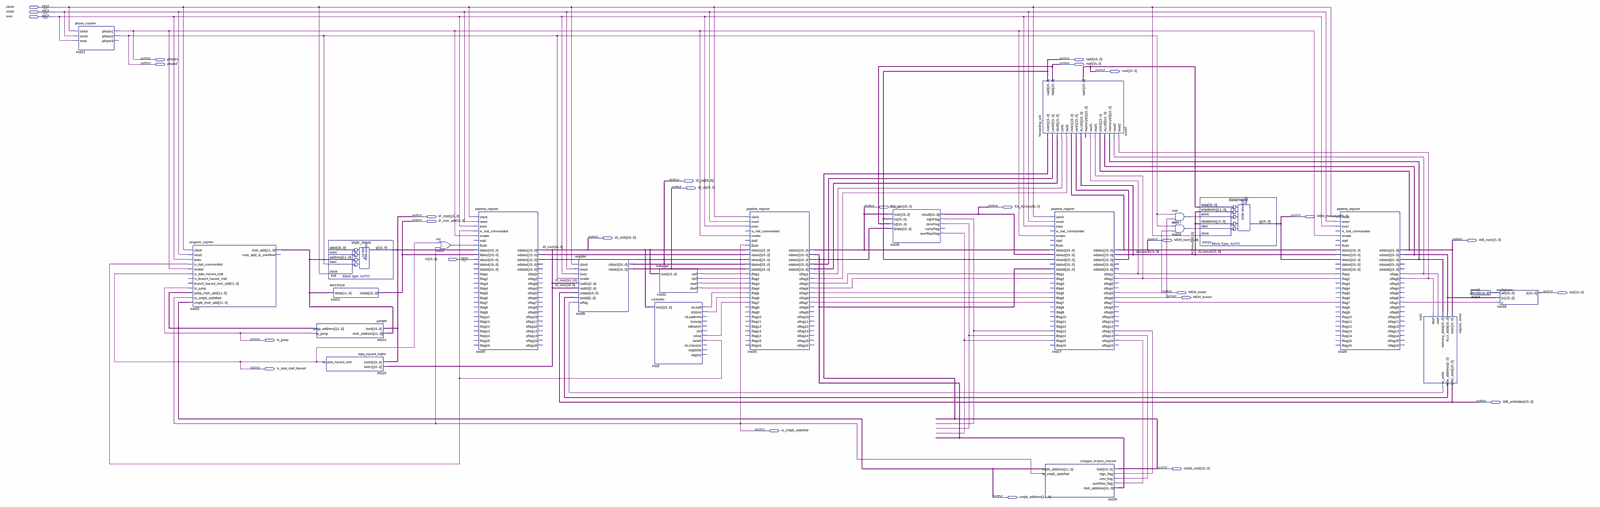
[diagram p0: schematic sheet, whole]
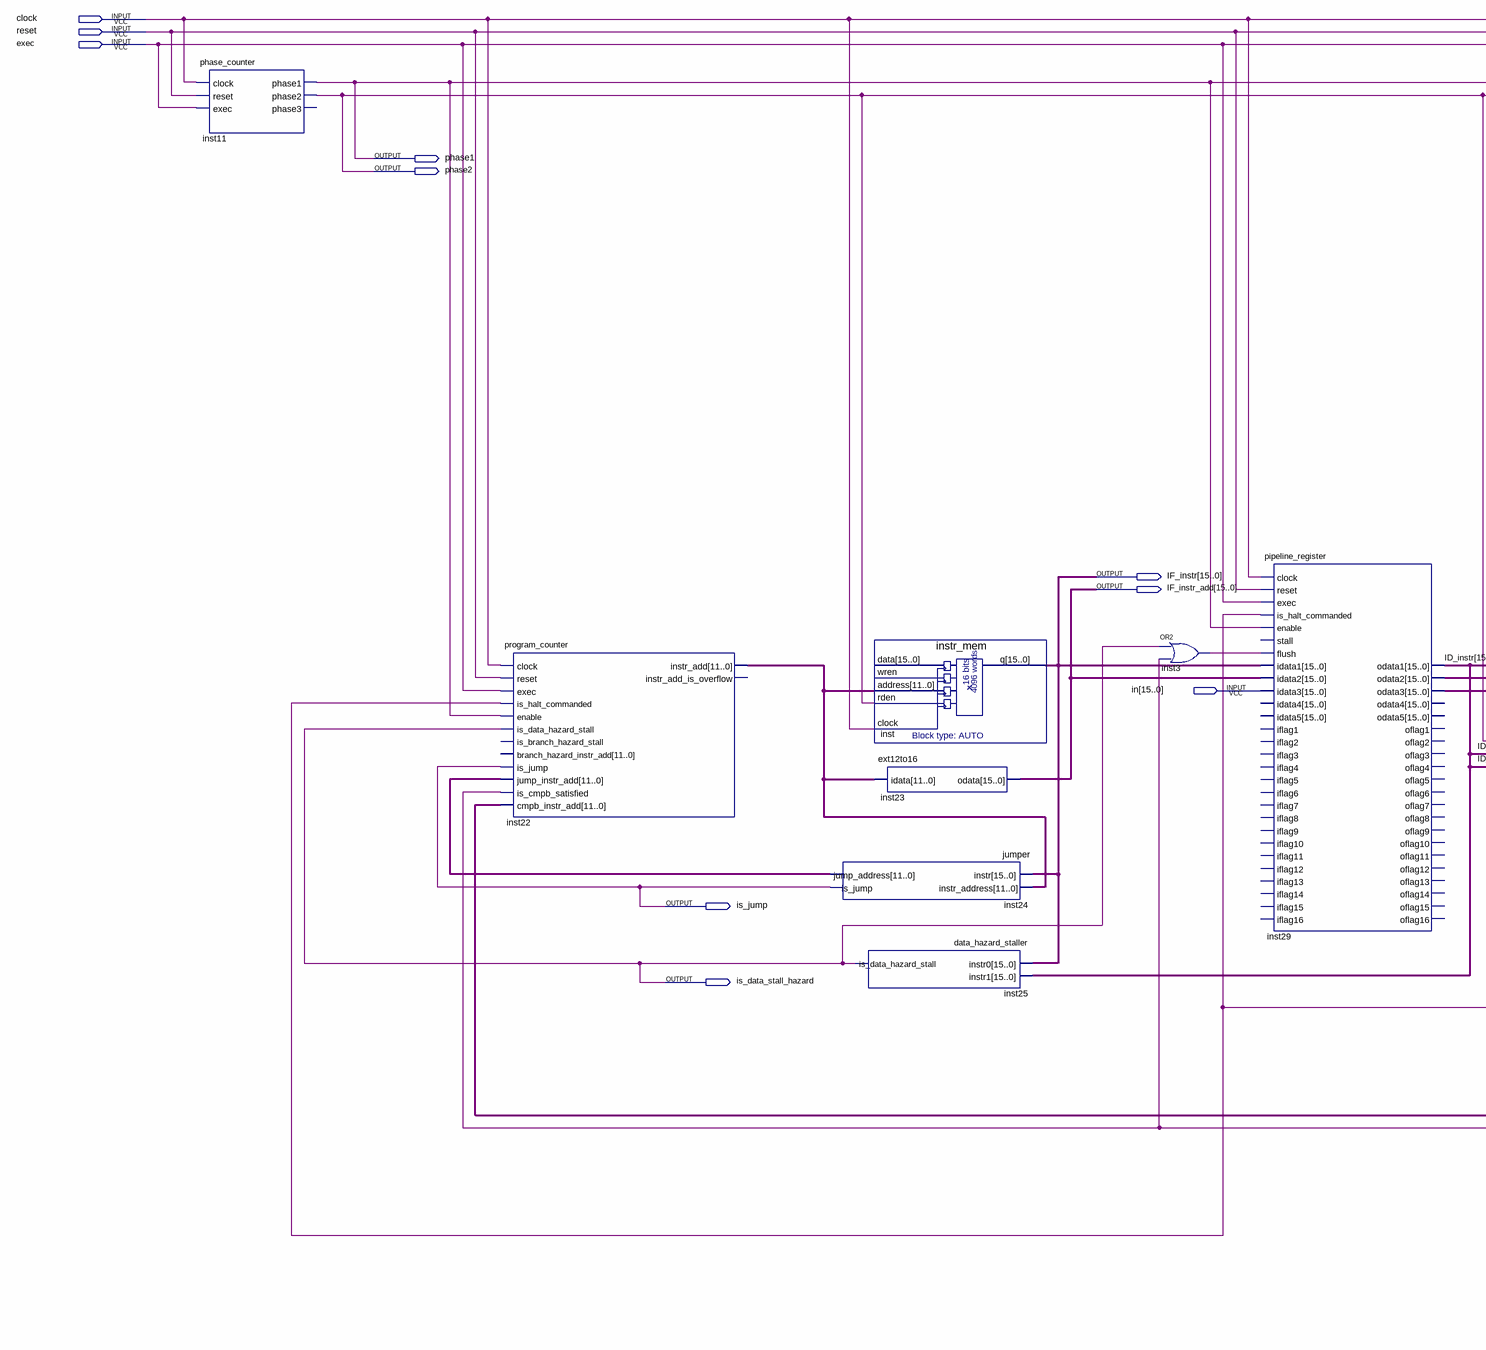
[diagram p1: schematic sheet, left part]
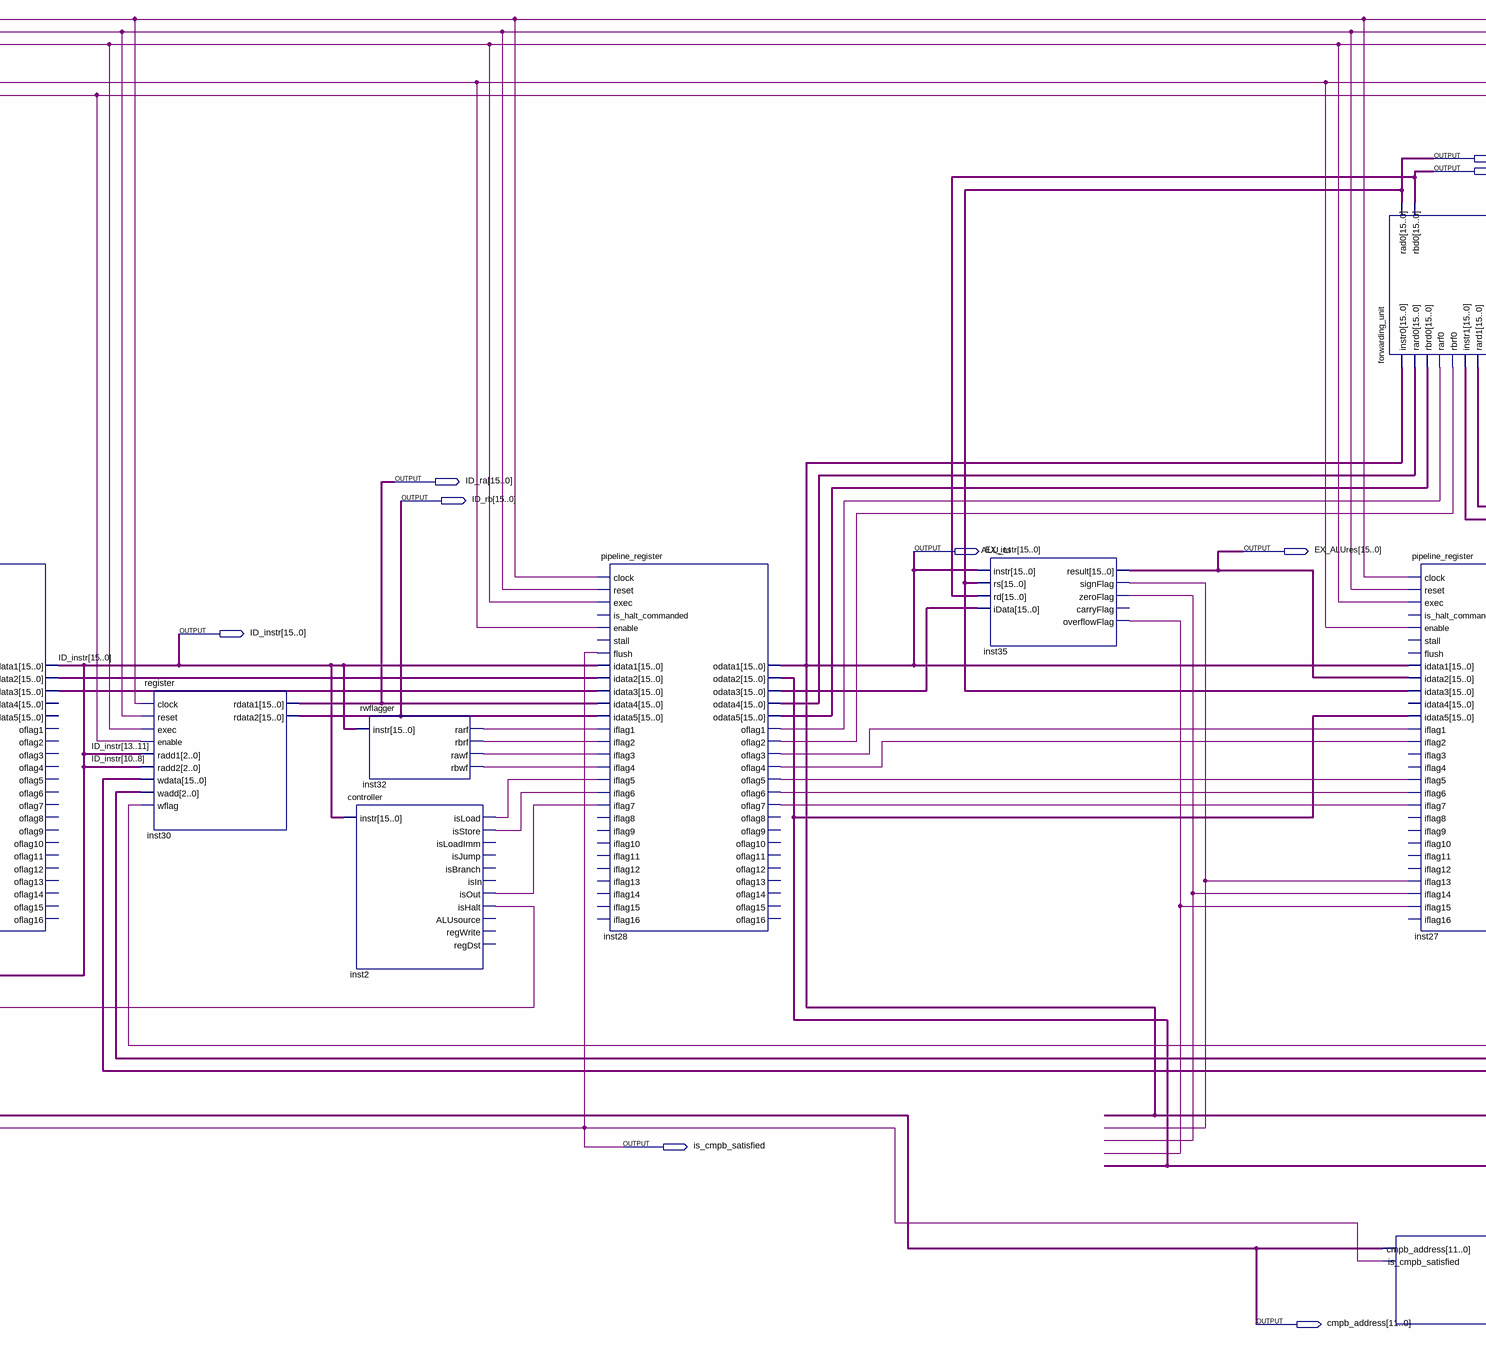
[diagram p2: schematic sheet, centre part]
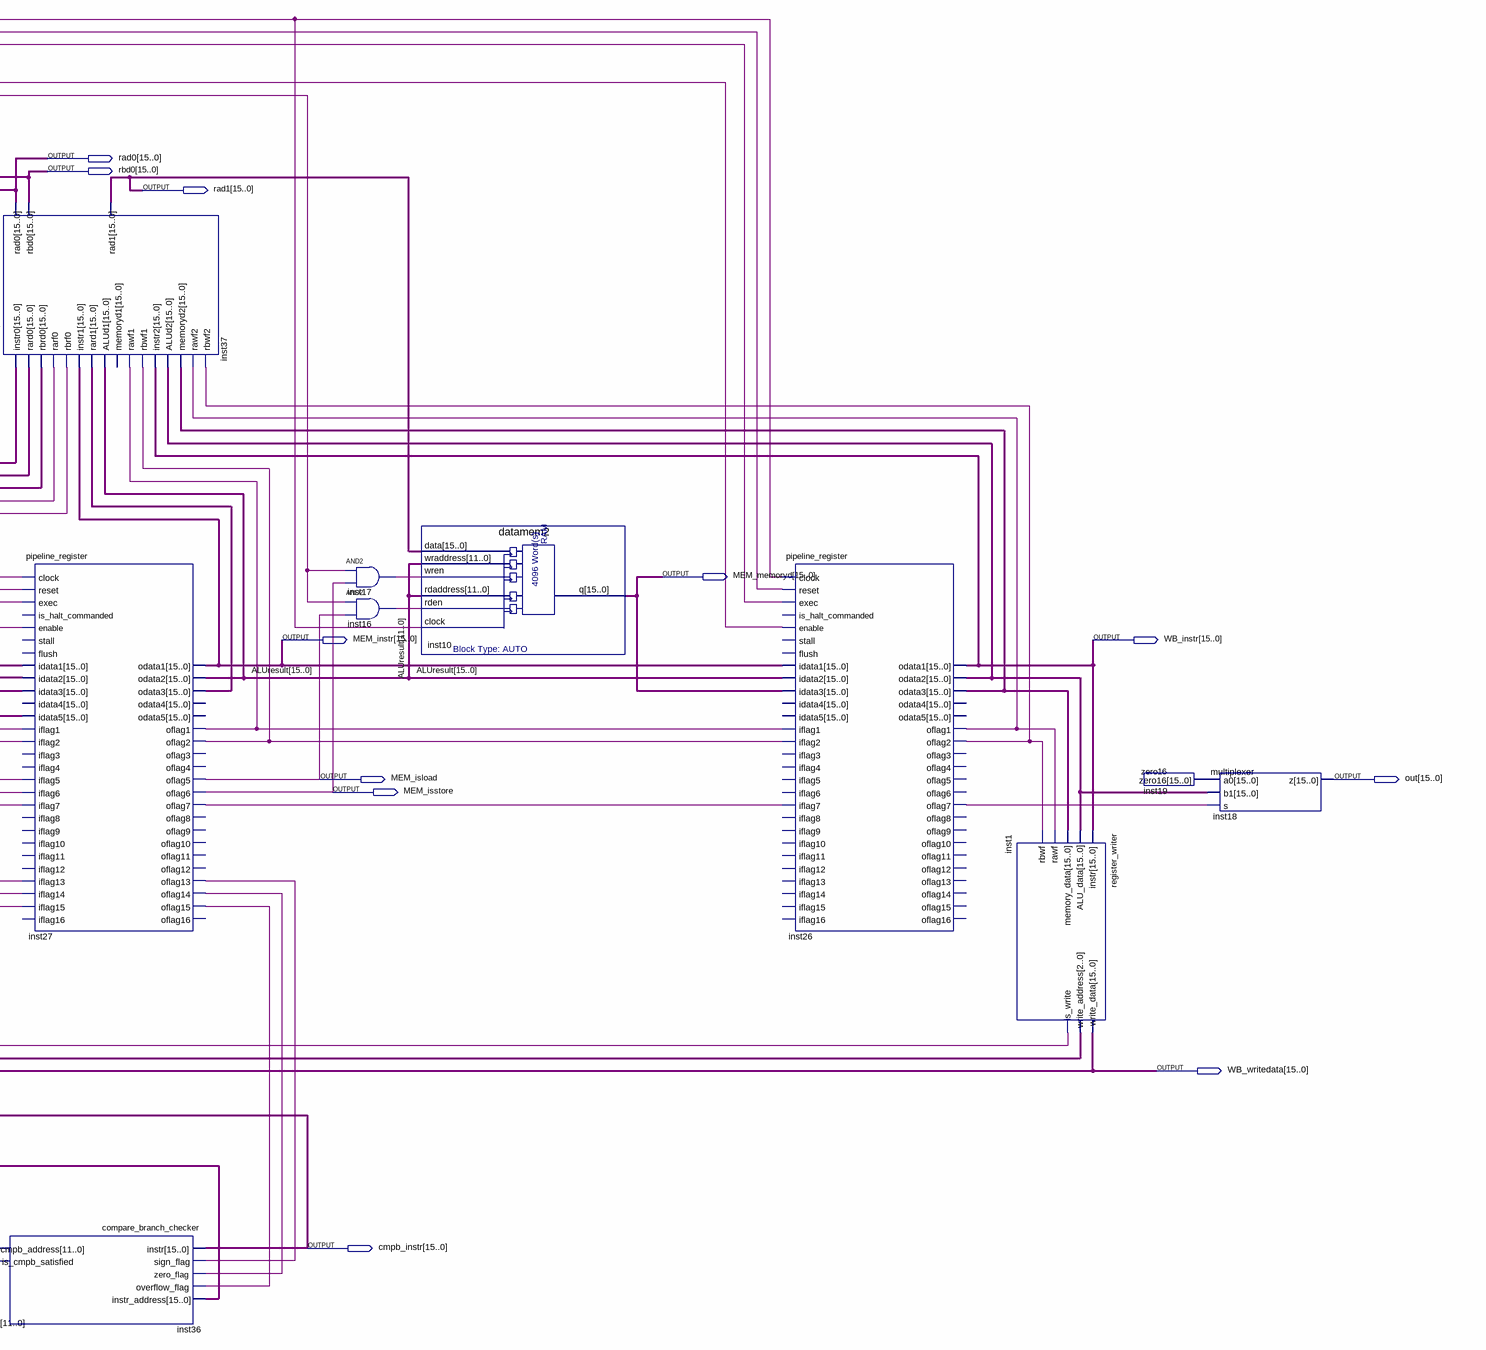
[diagram p3: schematic sheet, right part]
// Quartus schematic top.bdf as structural Verilog: 23 symbols, 28 pins
module top (
  input  clock,
  input  reset,
  input  exec,
  input  [15:0] in,
  output phase1,
  output [15:0] rad0,
  output phase2,
  output [15:0] rbd0,
  output [15:0] rad1,
  output [15:0] ID_ra,
  output [15:0] ID_rb,
  output [15:0] EX_instr,
  output [15:0] EX_ALUres,
  output [15:0] IF_instr,
  output [15:0] MEM_memoryd,
  output [15:0] IF_instr_add,
  output [15:0] ID_instr,
  output [15:0] MEM_instr,
  output [15:0] WB_instr,
  output MEM_isload,
  output [15:0] out,
  output MEM_isstore,
  output is_jump,
  output is_data_stall_hazard,
  output [15:0] WB_writedata,
  output is_cmpb_satisfied,
  output [15:0] cmpb_instr,
  output [11:0] cmpb_address
);

  wire inst1_is_write, inst2_ishalt, inst2_isload, inst2_isout, inst2_isstore, inst3_out, inst16_out,
       inst17_out, inst26_oflag1, inst26_oflag2, inst26_oflag7, inst27_oflag1, inst27_oflag2, inst27_oflag7,
       inst27_oflag13, inst27_oflag14, inst27_oflag15, inst28_oflag1, inst28_oflag2, inst28_oflag3,
       inst28_oflag4, inst28_oflag5, inst28_oflag6, inst28_oflag7, inst32_rarf, inst32_rawf, inst32_rbrf,
       inst32_rbwf, inst35_overflowflag, inst35_signflag, inst35_zeroflag;
  wire [2:0] inst1_write_address;
  wire [11:0] inst22_instr_add, inst24_jump_address;
  wire [15:0] ALUresult, inst19_zero16, inst26_odata2, inst26_odata3, inst27_odata3, inst28_odata2,
       inst28_odata3, inst28_odata4, inst28_odata5, inst29_odata2, inst29_odata3;

  phase_counter inst11 (.clock(clock), .reset(reset), .exec(exec), .phase1(phase1), .phase2(phase2));  // open: phase3
  program_counter inst22 (
    .clock(clock), .reset(reset), .exec(exec), .is_halt_commanded(inst2_ishalt), .enable(phase1),
    .is_data_hazard_stall(is_data_stall_hazard), .is_jump(is_jump), .jump_instr_add(inst24_jump_address),
    .is_cmpb_satisfied(is_cmpb_satisfied), .cmpb_instr_add(cmpb_address), .instr_add(inst22_instr_add));  // open: is_branch_hazard_stall, branch_hazard_instr_add, instr_add_is_overflow
  jumper inst24 (
    .instr(IF_instr), .instr_address(inst22_instr_add), .jump_address(inst24_jump_address), .is_jump(is_jump));
  data_hazard_staller inst25 (.instr0(IF_instr), .instr1(ID_instr), .is_data_hazard_stall(is_data_stall_hazard));
  instr_mem inst (.address(inst22_instr_add), .rden(phase2), .clock(clock), .q(IF_instr));  // open: data, wren
  ext12to16 inst23 (.idata(inst22_instr_add), .odata(IF_instr_add));
  or inst3 (inst3_out, is_data_stall_hazard, is_cmpb_satisfied);
  pipeline_register inst29 (
    .clock(clock), .reset(reset), .exec(exec), .is_halt_commanded(inst2_ishalt), .enable(phase1),
    .flush(inst3_out), .idata1(IF_instr), .idata2(IF_instr_add), .idata3(in), .odata1(ID_instr),
    .odata2(inst29_odata2), .odata3(inst29_odata3));  // open: stall, idata4, idata5, iflag1, iflag2, iflag3, iflag4, iflag5, iflag6, iflag7, iflag8, iflag9, iflag10, iflag11, iflag12, iflag13, iflag14, iflag15, iflag16, odata4, odata5, oflag1, oflag2, oflag3, oflag4, oflag5, oflag6, oflag7, oflag8, oflag9, oflag10, oflag11, oflag12, oflag13, oflag14, oflag15, oflag16
  register inst30 (
    .clock(clock), .reset(reset), .exec(exec), .enable(phase2), .radd1(ID_instr[13:11]),
    .radd2(ID_instr[10:8]), .wdata(WB_writedata), .wadd(inst1_write_address), .wflag(inst1_is_write),
    .rdata1(ID_ra), .rdata2(ID_rb));
  rwflagger inst32 (.instr(ID_instr), .rarf(inst32_rarf), .rbrf(inst32_rbrf), .rawf(inst32_rawf), .rbwf(inst32_rbwf));
  controller inst2 (
    .instr(ID_instr), .isLoad(inst2_isload), .isStore(inst2_isstore), .isOut(inst2_isout),
    .isHalt(inst2_ishalt));  // open: isLoadImm, isJump, isBranch, isIn, ALUsource, regWrite, regDst
  pipeline_register inst28 (
    .clock(clock), .reset(reset), .exec(exec), .enable(phase1), .flush(is_cmpb_satisfied), .idata1(ID_instr),
    .idata2(inst29_odata2), .idata3(inst29_odata3), .idata4(ID_ra), .idata5(ID_rb), .iflag1(inst32_rarf),
    .iflag2(inst32_rbrf), .iflag3(inst32_rawf), .iflag4(inst32_rbwf), .iflag5(inst2_isload),
    .iflag6(inst2_isstore), .iflag7(inst2_isout), .odata1(cmpb_instr), .odata2(inst28_odata2),
    .odata3(inst28_odata3), .odata4(inst28_odata4), .odata5(inst28_odata5), .oflag1(inst28_oflag1),
    .oflag2(inst28_oflag2), .oflag3(inst28_oflag3), .oflag4(inst28_oflag4), .oflag5(inst28_oflag5),
    .oflag6(inst28_oflag6), .oflag7(inst28_oflag7));  // open: is_halt_commanded, stall, iflag8, iflag9, iflag10, iflag11, iflag12, iflag13, iflag14, iflag15, iflag16, oflag8, oflag9, oflag10, oflag11, oflag12, oflag13, oflag14, oflag15, oflag16
  ALU_LI inst35 (
    .instr(cmpb_instr), .rs(rad0), .rd(rbd0), .iData(inst28_odata3), .result(EX_ALUres),
    .signFlag(inst35_signflag), .zeroFlag(inst35_zeroflag), .overflowFlag(inst35_overflowflag));  // open: carryFlag
  forwarding_unit inst37 (
    .instr0(cmpb_instr), .instr1(MEM_instr), .instr2(WB_instr), .rard0(inst28_odata4), .rbrd0(inst28_odata5),
    .rard1(inst27_odata3), .ALUd1(ALUresult), .ALUd2(inst26_odata2), .memoryd2(inst26_odata3),
    .rarf0(inst28_oflag1), .rbrf0(inst28_oflag2), .rawf1(inst27_oflag1), .rbwf1(inst27_oflag2),
    .rawf2(inst26_oflag1), .rbwf2(inst26_oflag2), .rad0(rad0), .rbd0(rbd0), .rad1(rad1));  // open: memoryd1
  compare_branch_checker inst36 (
    .instr(cmpb_instr), .sign_flag(inst27_oflag13), .zero_flag(inst27_oflag14),
    .overflow_flag(inst27_oflag15), .instr_address(inst28_odata2), .cmpb_address(cmpb_address),
    .is_cmpb_satisfied(is_cmpb_satisfied));
  pipeline_register inst27 (
    .clock(clock), .reset(reset), .exec(exec), .enable(phase1), .idata1(cmpb_instr), .idata2(EX_ALUres),
    .idata3(rad0), .idata5(inst28_odata2), .iflag1(inst28_oflag3), .iflag2(inst28_oflag4),
    .iflag5(inst28_oflag5), .iflag6(inst28_oflag6), .iflag7(inst28_oflag7), .iflag13(inst35_signflag),
    .iflag14(inst35_zeroflag), .iflag15(inst35_overflowflag), .odata1(MEM_instr), .odata2(ALUresult),
    .odata3(inst27_odata3), .oflag1(inst27_oflag1), .oflag2(inst27_oflag2), .oflag5(MEM_isload),
    .oflag6(MEM_isstore), .oflag7(inst27_oflag7), .oflag13(inst27_oflag13), .oflag14(inst27_oflag14),
    .oflag15(inst27_oflag15));  // open: is_halt_commanded, stall, flush, idata4, iflag3, iflag4, iflag8, iflag9, iflag10, iflag11, iflag12, iflag16, odata4, odata5, oflag3, oflag4, oflag8, oflag9, oflag10, oflag11, oflag12, oflag16
  and inst17 (inst17_out, phase2, MEM_isstore);
  and inst16 (inst16_out, phase2, MEM_isload);
  datamem2 inst10 (
    .data(rad1), .wraddress(ALUresult[11:0]), .wren(inst17_out), .rdaddress(ALUresult[11:0]),
    .rden(inst16_out), .clock(clock), .q(MEM_memoryd));
  pipeline_register inst26 (
    .clock(clock), .reset(reset), .exec(exec), .enable(phase1), .idata1(MEM_instr), .idata2(ALUresult),
    .idata3(MEM_memoryd), .iflag1(inst27_oflag1), .iflag2(inst27_oflag2), .iflag7(inst27_oflag7),
    .odata1(WB_instr), .odata2(inst26_odata2), .odata3(inst26_odata3), .oflag1(inst26_oflag1),
    .oflag2(inst26_oflag2), .oflag7(inst26_oflag7));  // open: is_halt_commanded, stall, flush, idata4, idata5, iflag3, iflag4, iflag5, iflag6, iflag8, iflag9, iflag10, iflag11, iflag12, iflag13, iflag14, iflag15, iflag16, odata4, odata5, oflag3, oflag4, oflag5, oflag6, oflag8, oflag9, oflag10, oflag11, oflag12, oflag13, oflag14, oflag15, oflag16
  register_writer inst1 (
    .instr(WB_instr), .ALU_data(inst26_odata2), .memory_data(inst26_odata3), .rawf(inst26_oflag1),
    .rbwf(inst26_oflag2), .write_data(WB_writedata), .write_address(inst1_write_address),
    .is_write(inst1_is_write));
  zero16 inst19 (.zero16(inst19_zero16));
  multiplexer inst18 (.a0(inst19_zero16), .b1(inst26_odata2), .s(inst26_oflag7), .z(out));

  assign EX_instr = cmpb_instr;
endmodule
